# EAGLE design tomo (EAGLE 9.4.2)

## Sheet 1 of 3
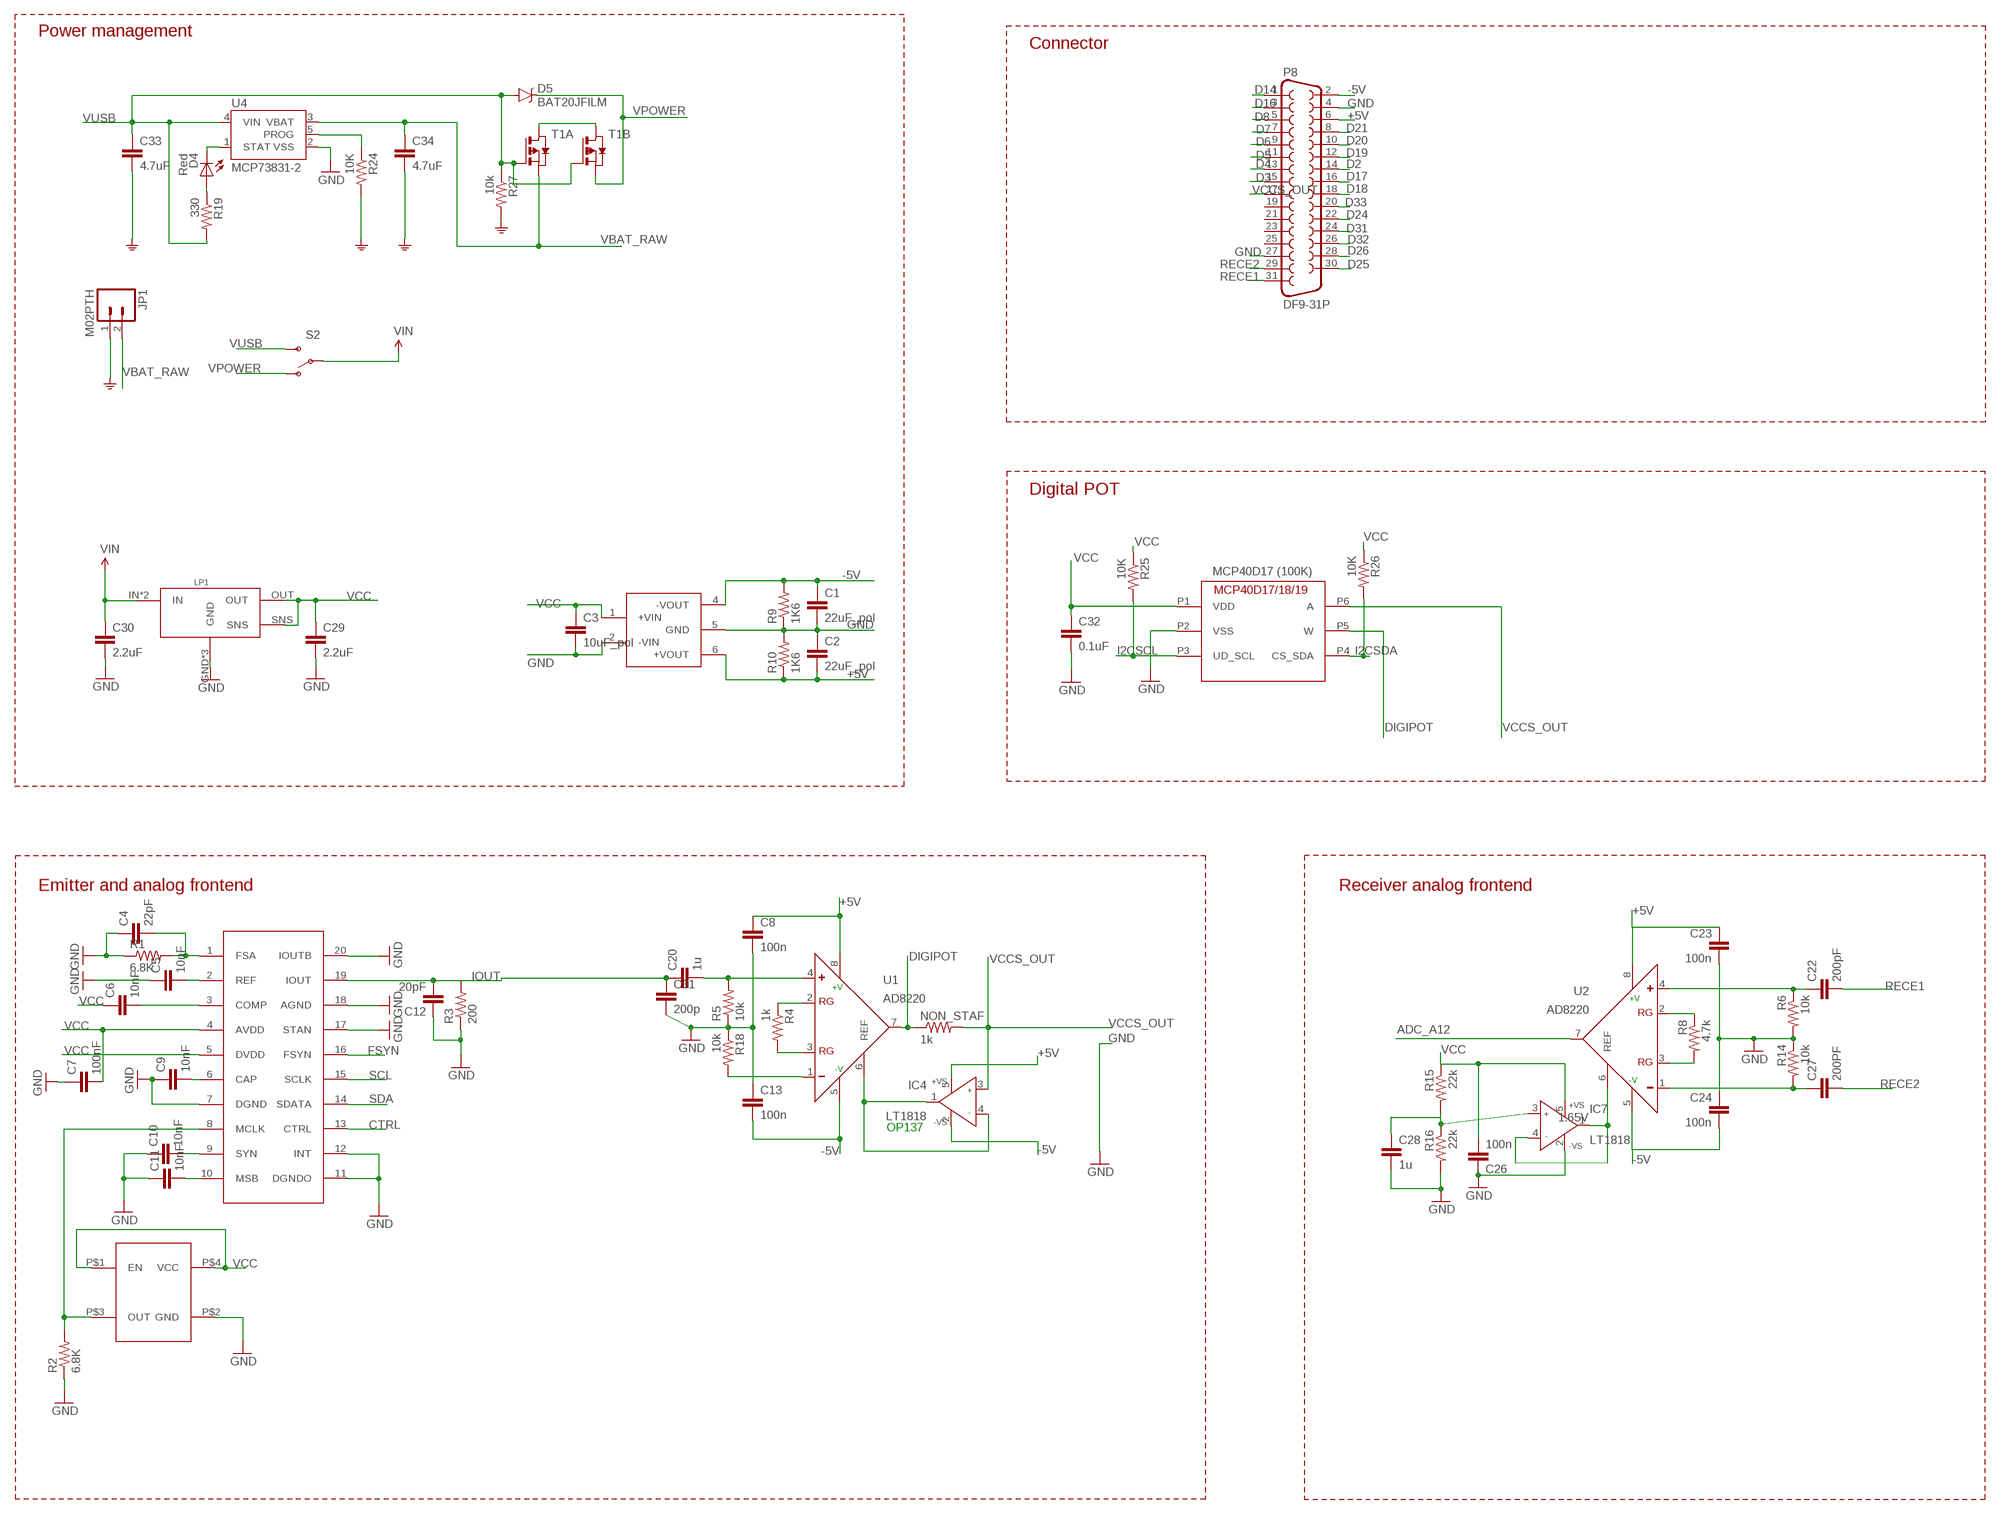
[diagram p0: schematic, sheet 1]

### Parts
C1  22uF_pol  0.1UF-25V(+80/-20%)(0603)  [0603-CAP]
C2  22uF_pol  0.1UF-25V(+80/-20%)(0603)  [0603-CAP]
C3  10uF_pol  0.1UF-25V(+80/-20%)(0603)  [0603-CAP]
C4  22pF  1.0UF-16V-10%(0603)  [0603-CAP]
C5  10nF  1.0UF-16V-10%(0603)  [0603-CAP]
C6  10nF  1.0UF-16V-10%(0603)  [0603-CAP]
C7  100nF  1.0UF-16V-10%(0603)  [0603-CAP]
C8  100n  0.1UF-25V(+80/-20%)(0603)  [0603-CAP]
C9  10nF  1.0UF-16V-10%(0603)  [0603-CAP]
C10  10nF  1.0UF-16V-10%(0603)  [0603-CAP]
C11  10nF  1.0UF-16V-10%(0603)  [0603-CAP]
C12  20pF  1.0UF-16V-10%(0603)  [0603-CAP]
C13  100n  0.1UF-25V(+80/-20%)(0603)  [0603-CAP]
C20  1u  0.1UF-25V(+80/-20%)(0603)  [0603-CAP]
C22  200pF  0.1UF-25V(+80/-20%)(0603)  [0603-CAP]
C23  100n  0.1UF-25V(+80/-20%)(0603)  [0603-CAP]
C24  100n  0.1UF-25V(+80/-20%)(0603)  [0603-CAP]
C26  100n  0.1UF-25V(+80/-20%)(0603)  [0603-CAP]
C27  200PF  0.1UF-25V(+80/-20%)(0603)  [0603-CAP]
C28  1u  0.1UF-25V(+80/-20%)(0603)  [0603-CAP]
C29  2.2uF  0.1UF-16V(+-10%)(0402)  [0402-CAP]
C30  2.2uF  0.1UF-16V(+-10%)(0402)  [0402-CAP]
C31  200p  0.1UF-25V(+80/-20%)(0603)  [0603-CAP]
C32  0.1uF  0.1UF-16V(+-10%)(0402)  [0402-CAP]
C33  4.7uF  CAP0402-CAP  [0402-CAP]
C34  4.7uF  CAP0402-CAP  [0402-CAP]
D4  Red  LED0603  [LED-0603]
D5  BAT20JFILM  [SOD-323]
IC4  LT1818  AD8541RJ  [SOT23-5]
IC7  LT1818  AD8541RJ  [SOT23-5]
JP1  M02PTH  [1X02]
LP1  LP38691SD  [WSON_6]
NON_STAF  1k  1.2MOHMS-1/10W-1%(0603)  [0603-RES]
P8  DF9-31P  [DF9-31P]
R1  6.8K  1.5KOHM-1/10W-1%(0603)  [0603]
R2  6.8K  1.5KOHM-1/10W-1%(0603)  [0603]
R3  200  1.5KOHM-1/10W-1%(0603)  [0603]
R4  1k  1.2MOHMS-1/10W-1%(0603)  [0603-RES]
R5  10k  1.2MOHMS-1/10W-1%(0603)  [0603-RES]
R6  10k  0.05OHM-1/5W-1%(0603)  [0603]
R8  4.7k  0.05OHM-1/5W-1%(0603)  [0603]
R9  1K6  2.2KOHM-1/10W-1%(0603)  [0603-RES]
R10  1K6  2.2KOHM-1/10W-1%(0603)  [0603-RES]
R14  10k  0.05OHM-1/5W-1%(0603)  [0603]
R15  22k  0.05OHM-1/5W-1%(0603)  [0603]
R16  22k  0.05OHM-1/5W-1%(0603)  [0603]
R18  10k  1.2MOHMS-1/10W-1%(0603)  [0603-RES]
R19  330  RESISTOR0402-RES  [0402-RES]
R24  10K  RESISTOR0402-RES  [0402-RES]
R25  10K  RESISTOR0402  [0402-RES]
R26  10K  RESISTOR0402  [0402-RES]
R27  10k  RESISTOR0402-RES  [0402-RES]
S2  SWITCH-SPDT-SMD-A  [SWITCH-SPST-SMD-A]
T1  BSS84DW  PMOSFET2  [SOT363]
U1  AD8220  [MSOP8]
U2  AD8220  [MSOP8]
U4  MCP73831-2  MCP73831  [SOT23-5]
U$2  AD5930  [TSSOP-20]
U$3  OSC  [OSC]
U$4  DCDC_CONVERTOR  [DCDC_CONVERTOR]
U$6  MCP40D17/18/19  [SC70-6]

### Nets
1.65V: IC7.1(OUT) IC7.4(IN-) U2.6(REF)
+5V: C2.2 C8.1 C23.1 IC4.5(+VS) P8.6 R10.1 U1.8(+V) U2.8(+V) U$4.6(+VOUT)
-5V: C1.1 C13.2 C24.2 IC4.2(-VS) P8.2 R9.2 U1.5(-V) U2.5(-V) U$4.4(-VOUT)
ADC_A12: U2.7(OUT) ; also sheet 2
CTRL: U$2.13(CTRL) ; also sheet 2
D2: P8.14 ; also sheet 2
D3: P8.15 ; also sheet 2
D4: P8.13 ; also sheet 2
D5: P8.11 ; also sheet 2
D6: P8.9 ; also sheet 2
D7: P8.7 ; also sheet 2
D8: P8.5 ; also sheet 2
D14: P8.1 ; also sheet 2
D16: P8.3 ; also sheet 2
D17: P8.16 ; also sheet 2
D18: P8.18 ; also sheet 2
D19: P8.12 ; also sheet 2
D20: P8.10 ; also sheet 2
D21: P8.8 ; also sheet 2
D24: P8.22 ; also sheet 2
D25: P8.30 ; also sheet 2
D26: P8.28 ; also sheet 2
D31: P8.24 ; also sheet 2
D32: P8.26 ; also sheet 2
D33: P8.20 ; also sheet 2
DIGIPOT: NON_STAF.1 U1.7(OUT) U$6.P5(W)
FSYN: U$2.16(FSYN) ; also sheet 2
GND: C1.2 C2.1 C3.2 C4.1 C5.1 C7.1 C8.2 C9.1 C10.1 C11.1 C12.1 C13.1 C23.2 C24.1 C26.1 C28.2 C29.2 C30.2 C31.2 C32.2 C33.2 C34.2 IC7.2(-VS) JP1.1 LP1.GND LP1.N/C(GND) LP1.THERMAL(GND) P8.4 P8.27 R1.1 R2.1 R3.1 R5.1 R6.2 R9.1 R10.2 R14.1 R16.2 R18.1 R24.2 R27.2 U4.2(VSS) U$2.7(DGND) U$2.11(DGNDO) U$2.12(INT) U$2.17(STAN) U$2.18(AGND) U$2.20(IOUTB) U$3.P$2(GND) U$4.2(-VIN) U$4.5(GND) U$6.P2(VSS) ; also sheet 2,3
I2CSCL: R25.2 U$6.P3(UD_SCL) ; also sheet 2
I2CSDA: R26.2 U$6.P4(CS_SDA) ; also sheet 2
IOUT: C12.2 C20.1 C31.1 R3.2 U$2.19(IOUT)
N$1: C4.2 R1.2 U$2.1(FSA)
N$2: C6.2 U$2.3(COMP)
N$3: C5.2 U$2.2(REF)
N$4: C9.2 U$2.6(CAP)
N$5: R2.2 U$2.8(MCLK) U$3.P$3(OUT)
N$6: C10.2 U$2.9(SYN)
N$7: C11.2 U$2.10(MSB)
N$8: R4.1 U1.2(RG)
N$9: C28.1 IC7.3(IN+) R15.2 R16.1
N$15: C20.2 R5.2 U1.4(+)
N$16: R4.2 U1.3(RG)
N$24: IC4.1(OUT) IC4.4(IN-) U1.6(REF)
N$31: R18.2 U1.1(-)
N$33: D4.A R19.1
N$34: T1.3(A:D) T1.6(B:D)
N$36: C22.1 R6.1 U2.4(+)
N$37: C27.1 R14.2 U2.1(-)
N$38: R8.1 U2.2(RG)
N$39: R8.2 U2.3(RG)
PROG: R24.1 U4.5(PROG)
RECE1: C22.2 P8.31
RECE2: C27.2 P8.29
SCL: U$2.15(SCLK) ; also sheet 2
SDA: U$2.14(SDATA) ; also sheet 2
STAT: D4.C U4.1(STAT)
VBAT_RAW: C34.1 JP1.2 T1.4(A:S) U4.3(VBAT)
VCC: C3.1 C6.1 C7.2 C26.2 C29.1 C32.1 IC7.5(+VS) LP1.OUT LP1.SNS R15.1 R25.1 R26.1 U$2.4(AVDD) U$2.5(DVDD) U$3.P$1(EN) U$3.P$4(VCC) U$4.1(+VIN) U$6.P1(VDD)
VCCS_OUT: IC4.3(IN+) NON_STAF.2 P8.17 U$6.P6(A)
VIN: C30.1 LP1.IN LP1.IN2(IN) S2.2(P) ; also sheet 2
VPOWER: D5.C S2.1(O) T1.1(B:S)
VUSB: C33.1 D5.A R19.2 R27.1 S2.3(S) T1.2(B:G) T1.5(A:G) U4.4(VIN) ; also sheet 2
Unconnected: P8.19 P8.21 P8.23 P8.25

### Notes on the sheet
- Power management
- Connector
- Digital POT
- MCP40D17 (100K)
- Emitter and analog frontend | Receiver analog frontend
- OP137

## Sheet 2 of 3
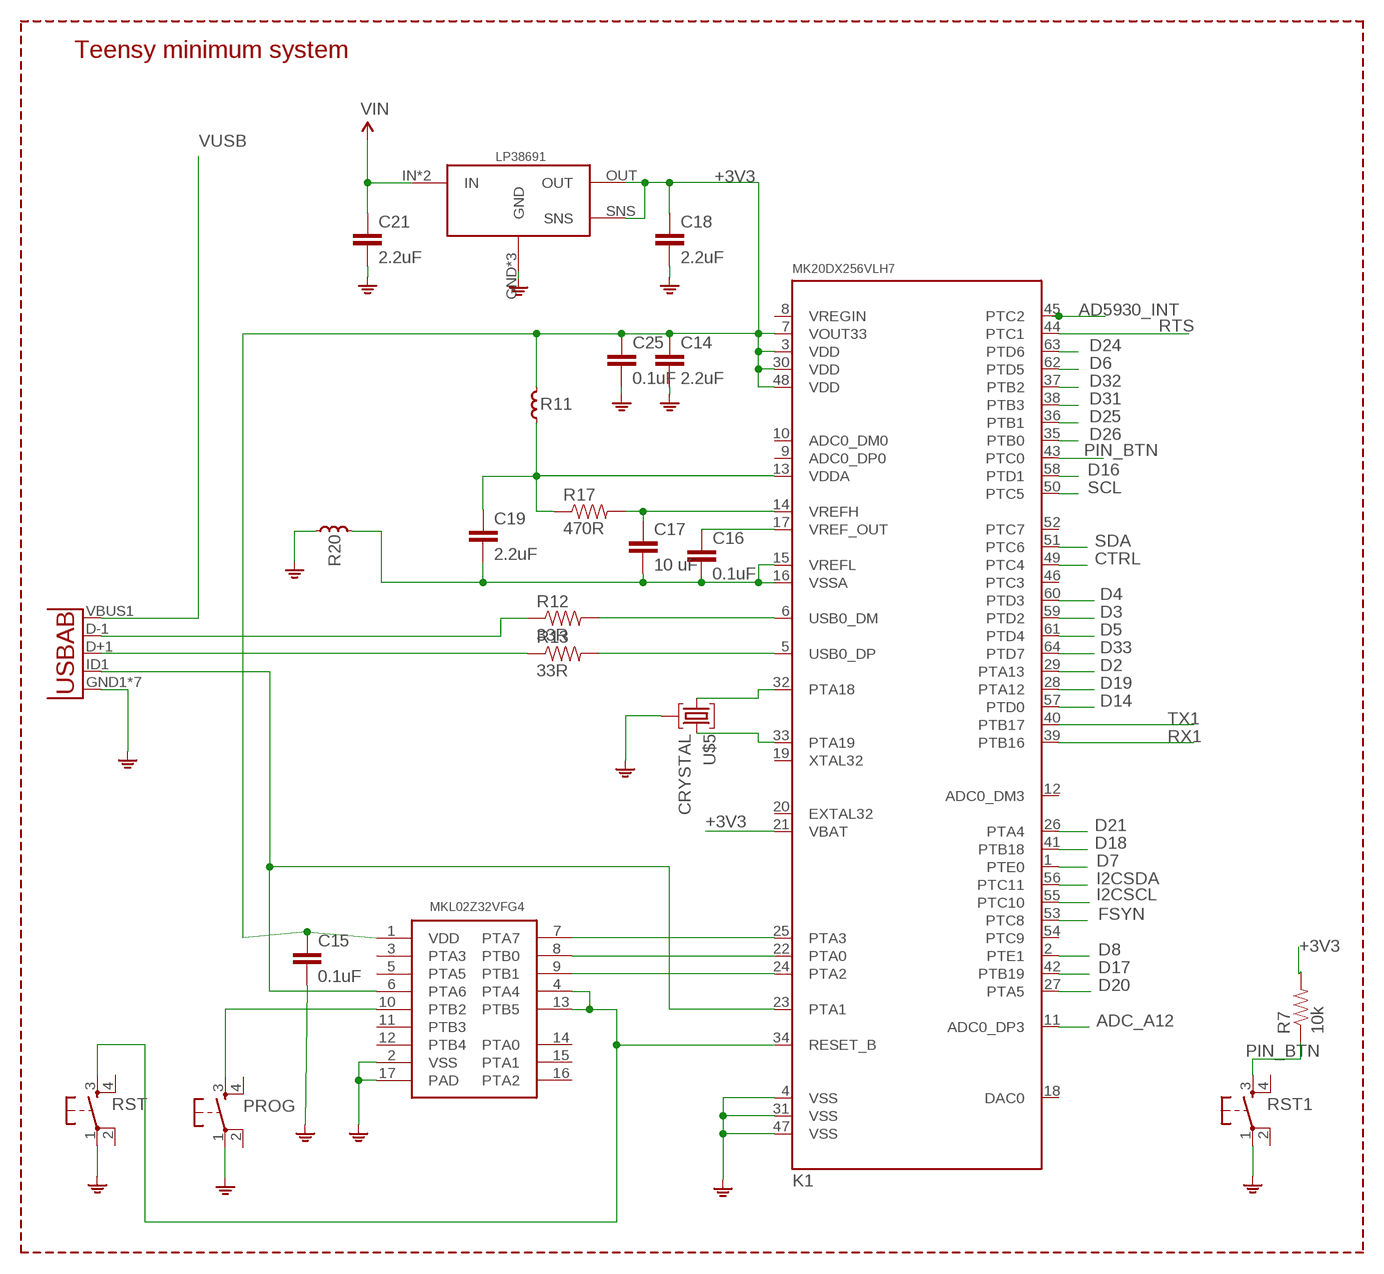
[diagram p1: schematic, sheet 2]

### Parts
C14  2.2uF  0.1UF-25V(+80/-20%)(0603)  [0603-CAP]
C15  0.1uF  0.1UF-16V(+-10%)(0402)  [0402-CAP]
C16  0.1uF  0.1UF-16V(+-10%)(0402)  [0402-CAP]
C17  10 uF  0.1UF-16V(+-10%)(0402)  [0402-CAP]
C18  2.2uF  0.1UF-16V(+-10%)(0402)  [0402-CAP]
C19  2.2uF  0.1UF-16V(+-10%)(0402)  [0402-CAP]
C21  2.2uF  0.1UF-16V(+-10%)(0402)  [0402-CAP]
C25  0.1uF  0.1UF-16V(+-10%)(0402)  [0402-CAP]
K1  MK20DX256VLH7  [LQFP64-05]
LP38691  LP38691SD  [WSON_6]
PROG  KMR211GLFS  TAC_SWITCHSMD  [TACTILE_SWITCH_SMD]
R7  10k  22OHM1/10W1%(0402)  [0402-RES]
R11  FERRITE  [L0603]
R12  33R  22OHM1/10W1%(0402)  [0402-RES]
R13  33R  22OHM1/10W1%(0402)  [0402-RES]
R17  470R  22OHM1/10W1%(0402)  [0402-RES]
R20  FERRITE  [L0603]
RST  KMR211GLFS  TAC_SWITCHSMD  [TACTILE_SWITCH_SMD]
RST1  KMR211GLFS  TAC_SWITCHSMD  [TACTILE_SWITCH_SMD]
U5  USB""  [USB-MICRO-SMD]
U$5  CRYSTAL  [CRYSTAL]
U$14  MKL02Z32VFG4_  [QFN16_3X3]

### Nets
+3V3: C14.1 C15.1 C18.1 C25.1 K1.3(VDD) K1.7(VOUT33) K1.21(VBAT) K1.30(VDD) K1.48(VDD) LP38691.OUT LP38691.SNS R7.2 R11.2 U$14.1(VDD) ; also sheet 3
AD5930_INT: K1.45(PTC2)
ADC_A12: K1.11(ADC0_DP3) ; also sheet 1
CTRL: K1.49(PTC4) ; also sheet 1
D2: K1.29(PTA13) ; also sheet 1
D3: K1.59(PTD2) ; also sheet 1
D4: K1.60(PTD3) ; also sheet 1
D5: K1.61(PTD4) ; also sheet 1
D6: K1.62(PTD5) ; also sheet 1
D7: K1.1(PTE0) ; also sheet 1
D8: K1.2(PTE1) ; also sheet 1
D14: K1.57(PTD0) ; also sheet 1
D16: K1.58(PTD1) ; also sheet 1
D17: K1.42(PTB19) ; also sheet 1
D18: K1.41(PTB18) ; also sheet 1
D19: K1.28(PTA12) ; also sheet 1
D20: K1.27(PTA5) ; also sheet 1
D21: K1.26(PTA4) ; also sheet 1
D24: K1.63(PTD6) ; also sheet 1
D25: K1.36(PTB1) ; also sheet 1
D26: K1.35(PTB0) ; also sheet 1
D31: K1.38(PTB3) ; also sheet 1
D32: K1.37(PTB2) ; also sheet 1
D33: K1.64(PTD7) ; also sheet 1
FSYN: K1.53(PTC8) ; also sheet 1
GND: C14.2 C15.2 C18.2 C21.2 C25.2 K1.4(VSS) K1.31(VSS) K1.47(VSS) LP38691.GND LP38691.N/C(GND) LP38691.THERMAL(GND) PROG.1 R20.1 RST1.1 RST.1 U5.GND1(GND) U5.P$1(GND) U5.P$2(GND) U5.P$3(GND) U5.P$4(GND) U5.P$5(GND) U5.P$6(GND) U$5.GND1 U$5.GND2 U$14.2(VSS) U$14.17(PAD) ; also sheet 1,3
I2CSCL: K1.55(PTC10) ; also sheet 1
I2CSDA: K1.56(PTC11) ; also sheet 1
N$10: K1.24(PTA2) U$14.9(PTB1)
N$11: K1.5(USB0_DP) R13.2
N$12: K1.6(USB0_DM) R12.2
N$13: R13.1 U5.D+1(D+)
N$14: C16.1 K1.17(VREF_OUT)
N$21: R12.1 U5.D-1(D-)
N$22: K1.23(PTA1) U5.ID1(USBID) U$14.6(PTA6)
N$23: K1.22(PTA0) U$14.8(PTB0)
N$25: K1.32(PTA18) U$5.SIG1
N$26: K1.33(PTA19) U$5.SIG2
N$27: C17.1 K1.14(VREFH) R17.2
N$28: C16.2 C17.2 C19.2 K1.15(VREFL) K1.16(VSSA) R20.2
N$29: C19.1 K1.13(VDDA) R11.1 R17.1
N$66: PROG.3 U$14.10(PTB2)
N$72: K1.25(PTA3) U$14.7(PTA7)
PIN_BTN: K1.43(PTC0) R7.1 RST1.3
RST: K1.34(RESET_B) RST.3 U$14.4(PTA4) U$14.13(PTB5)
RTS: K1.44(PTC1) ; also sheet 3
RX1: K1.39(PTB16) ; also sheet 3
SCL: K1.50(PTC5) ; also sheet 1
SDA: K1.51(PTC6) ; also sheet 1
TX1: K1.40(PTB17) ; also sheet 3
VIN: C21.1 LP38691.IN LP38691.IN2(IN) ; also sheet 1
VUSB: U5.VBUS1(VBUS) ; also sheet 1
Unconnected: K1.8(VREGIN) K1.9(ADC0_DP0) K1.10(ADC0_DM0) K1.12(ADC0_DM3) K1.18(DAC0) K1.19(XTAL32) K1.20(EXTAL32) K1.46(PTC3) K1.52(PTC7) K1.54(PTC9) PROG.2 PROG.4 RST1.2 RST1.4 RST.2 RST.4 U$14.3(PTA3) U$14.5(PTA5) U$14.11(PTB3) U$14.12(PTB4) U$14.14(PTA0) U$14.15(PTA1) U$14.16(PTA2)

### Notes on the sheet
- Teensy minimum system

## Sheet 3 of 3
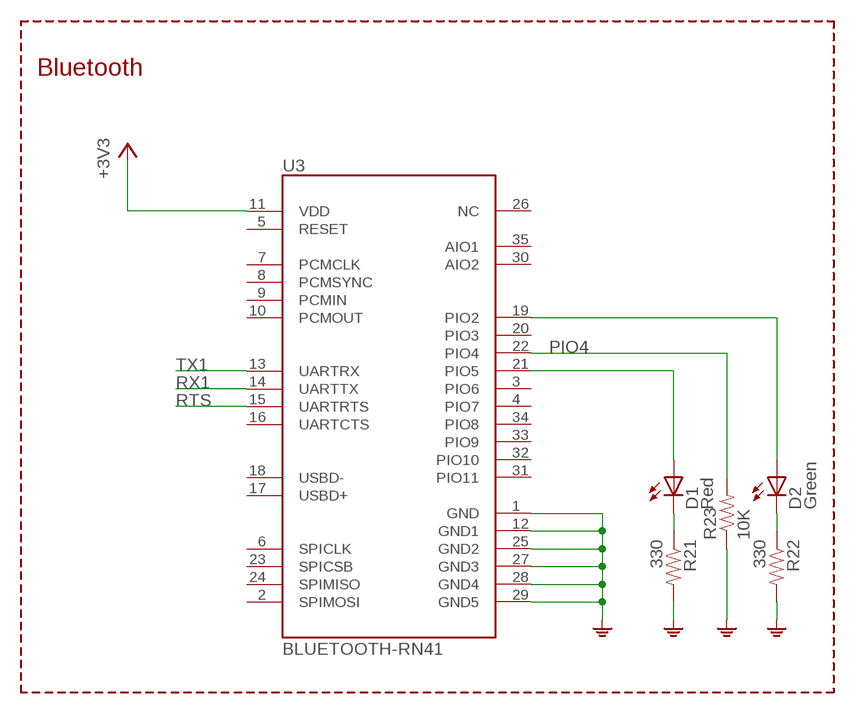
[diagram p2: schematic, sheet 3]

### Parts
D1  Red  LED0603  [LED-0603]
D2  Green  LED0603  [LED-0603]
R21  330  RESISTOR0402-RES  [0402-RES]
R22  330  RESISTOR0402-RES  [0402-RES]
R23  10K  RESISTOR0402-RES  [0402-RES]
U3  BLUETOOTH-RN41  BLUETOOTH-RN41"  [RN41]

### Nets
+3V3: U3.11(VDD) ; also sheet 2
D1: D1.C R21.1
D9: D2.C R22.1
GND: R21.2 R22.2 R23.1 U3.1(GND) U3.12(GND1) U3.25(GND2) U3.27(GND3) U3.28(GND4) U3.29(GND5) ; also sheet 1,2
N$30: D1.A U3.21(PIO5)
N$32: D2.A U3.19(PIO2)
PIO4: R23.2 U3.22(PIO4)
RTS: U3.15(UARTRTS) ; also sheet 2
RX1: U3.14(UARTTX) ; also sheet 2
TX1: U3.13(UARTRX) ; also sheet 2
Unconnected: U3.2(SPIMOSI) U3.3(PIO6) U3.4(PIO7) U3.5(RESET) U3.6(SPICLK) U3.7(PCMCLK) U3.8(PCMSYNC) U3.9(PCMIN) U3.10(PCMOUT) U3.16(UARTCTS) U3.17(USBD+) U3.18(USBD-) U3.20(PIO3) U3.23(SPICSB) U3.24(SPIMISO) U3.26(NC) U3.30(AIO2) U3.31(PIO11) U3.32(PIO10) U3.33(PIO9) U3.34(PIO8) U3.35(AIO1)

### Notes on the sheet
- Bluetooth

## Library data of the parts
C1-C3 C8 C13 C14 C20 C22-C24 C26-C28 C31 = SparkFun-Capacitors:0.1UF-25V(+80/-20%)(0603): CAP-00810 Ceramic Standard decoupling cap; PROD_ID: CAP-00810; VALUE: 0.1uF
C4-C7 C9-C12 = SparkFun-Capacitors:1.0UF-16V-10%(0603): CAP-00868; PROD_ID: CAP-00868; VALUE: 1.0uF
C15 C16 C25 C32 = SparkFun-Capacitors:0.1UF-16V(+-10%)(0402); PROD_ID: CAP-12416
C17-C19 C21 C29 C30 = SparkFun-Capacitors:0.1UF-16V(+-10%)(0402); PROD_ID: CAP-12416; VALUE: 0.1uF
C33 C34 = SparkFun:CAP: Capacitor Standard 0603 ceramic capacitor, and 0.1" leaded capacitor.
D1 D2 D4 = SparkFun:LED: LEDs Standard schematic elements and footprints for 5mm, 3mm, 1206, and 0603 sized LEDs. 5mm - Spark Fun Electronics SKU : COM-00529 (and others)
D5 = SparkFun-DiscreteSemi:BAT20JFILM: 23V, 1A Schottky diode, SOD-323 package; PROD_ID: DIO-11623
IC4 IC7 = analog-devices:AD8541: General-Purpose CMOS Rail-to-Rail Amplifiers Source: http://www.analog.com/static/imported-files/data_sheets/AD8541_8542_8544.pdf; MF: ALTERA CORPORATION; MPN: AD8541ARTZ-REEL7; OC_FARNELL: 1464963; OC_NEWARK: 88H0268
JP1 = SparkFun-Connectors:M02: Standard 2-pin 0.1" header. Use with - straight break away headers ( PRT-00116) - right angle break away headers (PRT-00553) - swiss pins (PRT-00743) - machine pins (PRT-00117) - female headers (PRT-00115) Molex polarized connector foot print use with: PRT-08233 with associated crimp pins and housings. 2.54_SCREWTERM for use with PRT-10571. 3.5mm Screw Terminal footprints for PRT-08084 5mm Screw Terminal footprints for use with PRT-08432
K1 = t32_ref:MK20DX256VLH7; DESC: MK20DX256VLH7; MF: NXP; MPN: MK20DX256VLH7; OC_MOUSER: 841-MK20DX256VLH7; PACKAGE: LQFP-64; TYPE: Microcontroller
LP1 LP38691 = Teensy_3_and_LC_Series_Boards_v1.1:LP38691SD
NON_STAF R4 R5 R18 = SparkFun-Resistors:1.2MOHMS-1/10W-1%(0603): RES-10055; PROD_ID: RES-10055; VALUE: 1.2M
P8 = con-hirose:DF9-31P
PROG RST RST1 = Spark:TAC_SWITCH: SMD Tactiile Switch
R1-R3 = SparkFun-Resistors:1.5KOHM-1/10W-1%(0603): RES-08306; PROD_ID: RES-08306; VALUE: 1.5KOHM
R6 R8 R14-R16 = SparkFun-Resistors:0.05OHM-1/5W-1%(0603); PROD_ID: RES-12535
R7 R12 R13 R17 = SparkFun-Resistors:22OHM1/10W1%(0402); PROD_ID: RES-12427; VALUE: 22
R9 R10 = SparkFun-Resistors:2.2KOHM-1/10W-1%(0603): RES-08272; PROD_ID: RES-08272; VALUE: 2.2k
R11 R20 = t32_ref:FERRITE; DESC: 600R / 100MHz; MF: Murata Electronics; MPN: BLM18AG601SN1D; OC_MOUSER: 81-BLM11A601S; PACKAGE: 0603; TYPE: Ferrite
R19 R21-R24 R27 = SparkFun:RESISTOR: Resistor Basic schematic elements and footprints for 0603, 1206, and PTH resistors.
R25 R26 = SparkFun-Resistors:RESISTOR: Resistor Basic schematic elements and footprints for 0603, 1206, and PTH resistors.
S2 = SparkFun-Electromechanical:SWITCH-SPDT: SPDT Switch Simple slide switch, Spark Fun Electronics SKU : COM-00102 DPDT SMT slide switch, AYZ0202, SWCH-08179
T1 = Teensy_3_and_LC_Series_Boards_v1.1:PMOSFET2
U1 U2 = openebi:AD8220
U3 = ScratchPad:BLUETOOTH-RN41
U4 = SparkFun:MCP73831: Microchip's MCP73831 Miniature single cell, fully integrated Li-Ion, Li-polymer charge management controller http://ww1.microchip.com/downloads/en/DeviceDoc/21984a.pdf
U5 = MicroUSB:USB: This is a USB AB connector that is compatible with USB OTG. i.e. this connector can serve as a host or device
U$2 = Teensy_3_and_LC_Series_Boards_v1.1:AD5930
U$3 = Teensy_3_and_LC_Series_Boards_v1.1:OSC
U$4 = MGC3130:DCDC_CONVERTOR
U$5 = Teensy_3_and_LC_Series_Boards_v1.1:CRYSTAL
U$6 = ff3:MCP40D17/18/19
U$14 = Teensy_3_and_LC_Series_Boards_v1.1:MKL02Z32VFG4_

## Board
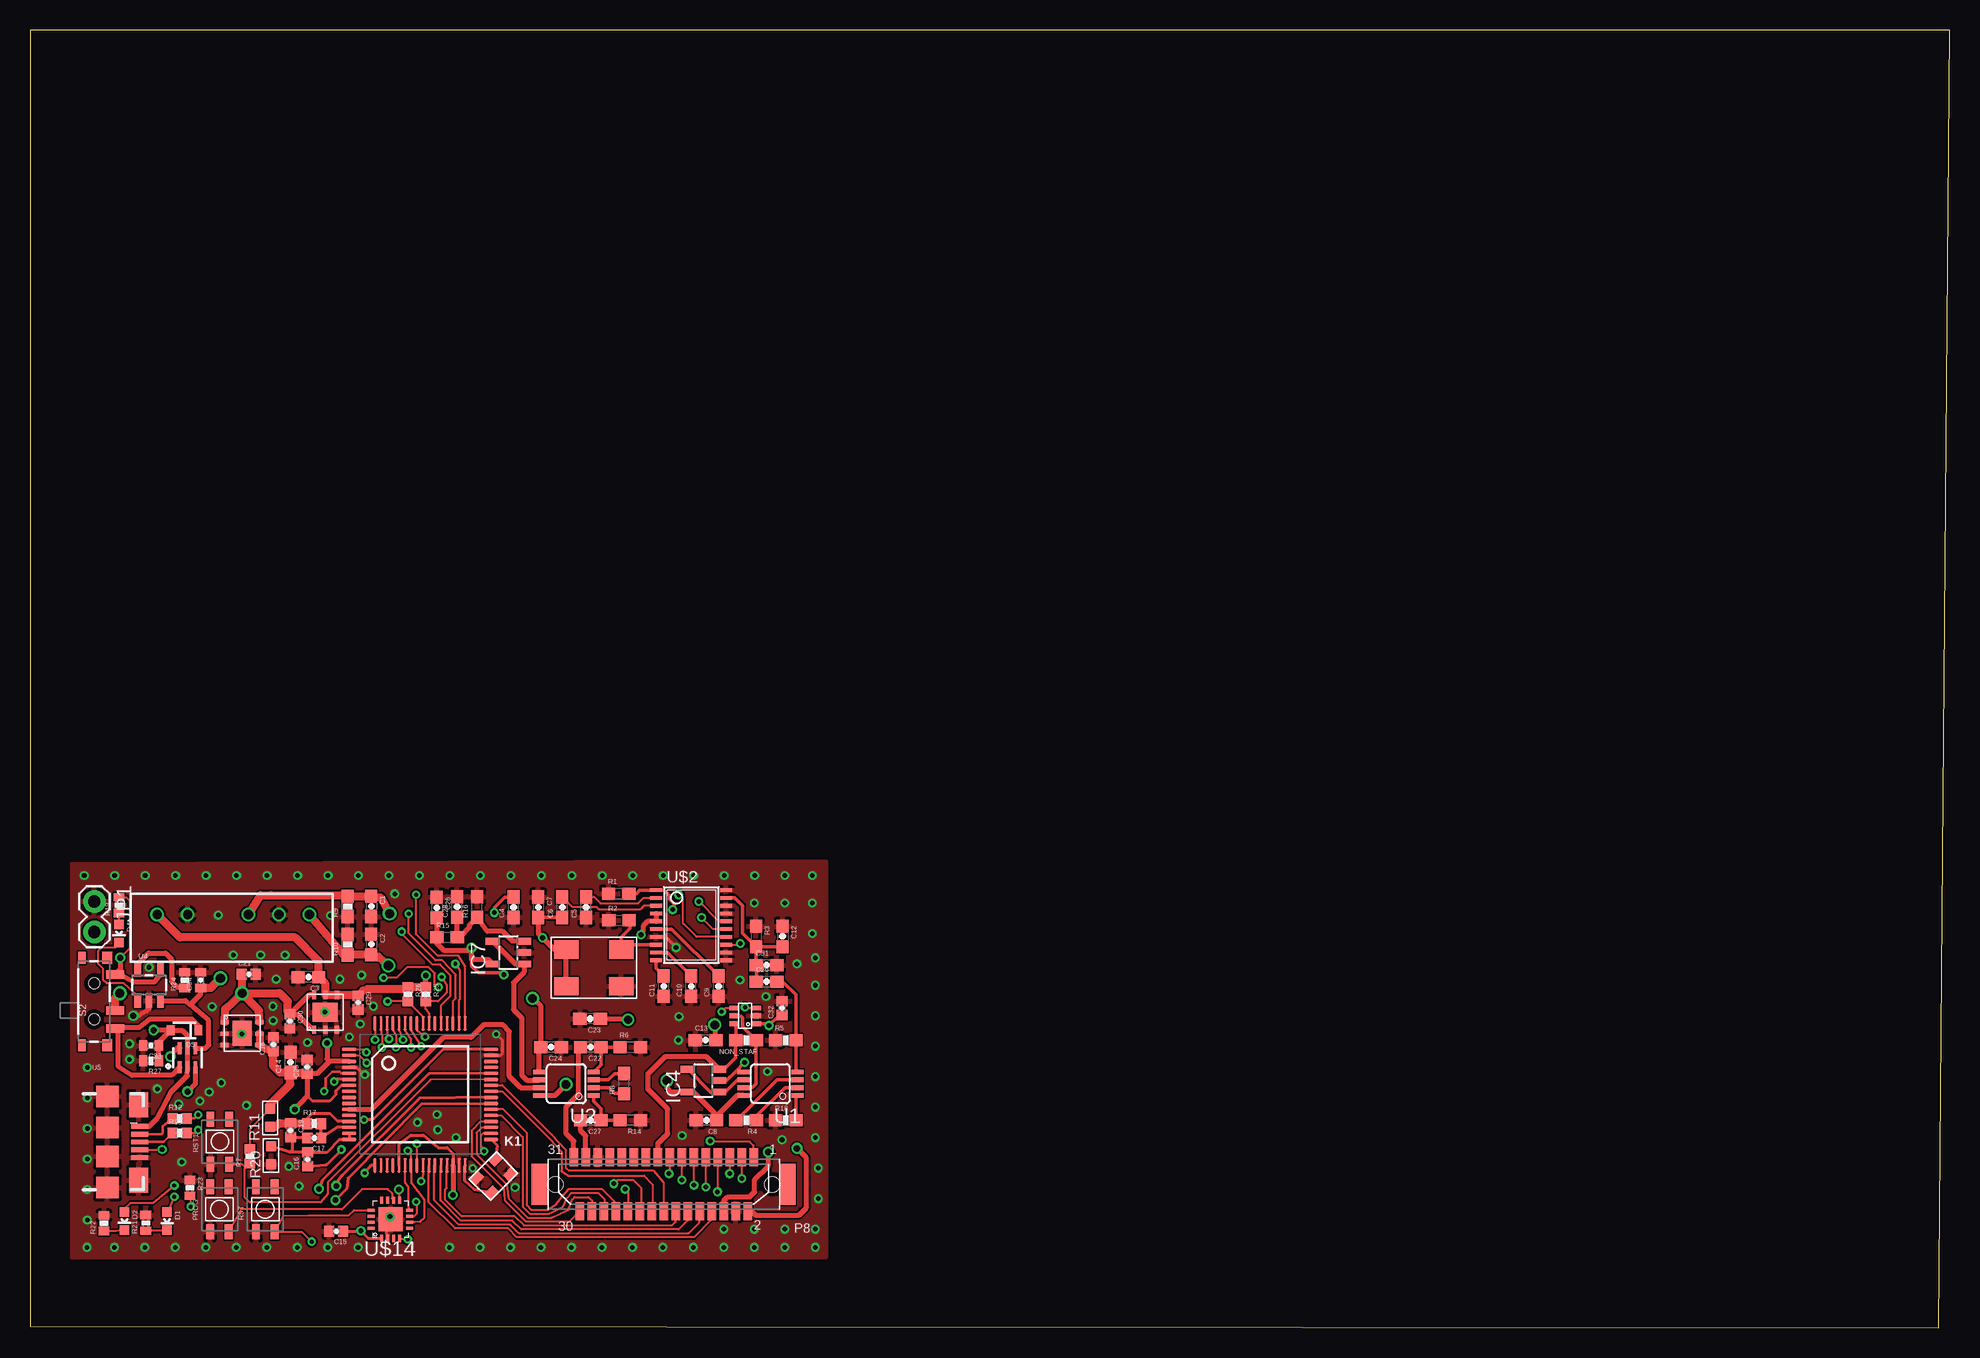
[diagram p3: board, top side]
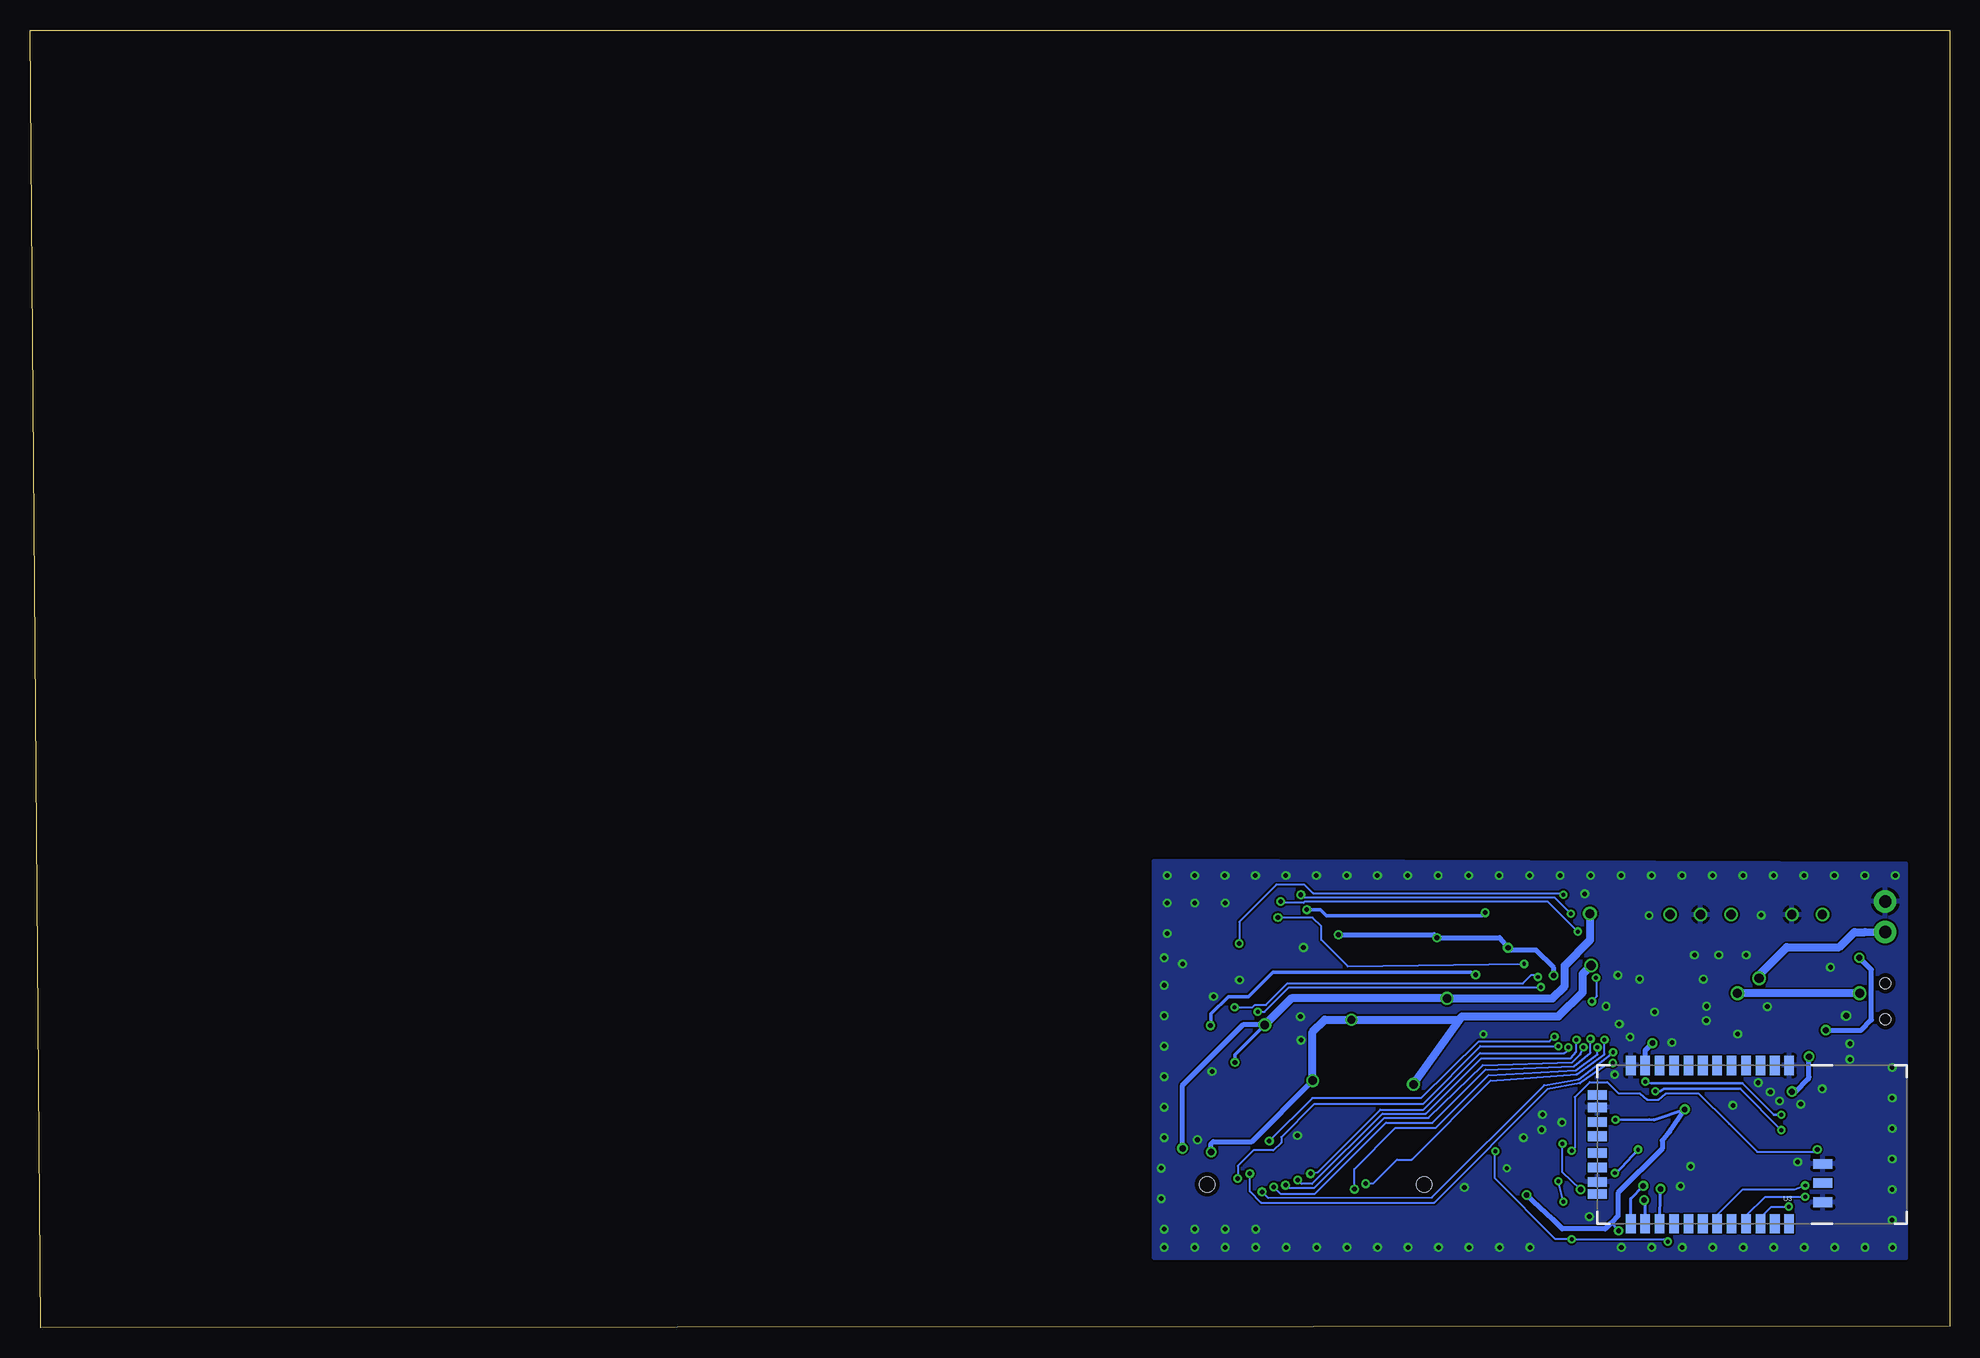
[diagram p4: board, bottom side, seen from below]

Size 160 x 108.15 mm. Coordinates in mm from the lower left corner, seen from the top.
Outline: 0,0.15 159.09,0 160,108.15 0,108.15 0,0.15
Copper layers (1*16): Top 0.0356mm / dielectric 1.5011mm / Bottom 0.0356mm
Design rules "oshpark-2layer": minimum track width 6mil, minimum drill 13mil, track to track 6mil, track to pad 6mil, pad to pad 6mil, via to via 6mil, smd to smd 6mil, copper to edge 15mil, drill to drill 6mil, minimum pad ring 7mil, minimum via ring 7mil, stop-mask expansion 2.5mil, vias tented up to drill 0mil, thermal gap 10mil

### Footprints (pad centres in the part's own frame; a part is rotated, then mirrored left to right if it is on the bottom)
0603-CAP = smd 1.1 x 1: 1 -0.85,0; 2 0.85,0
0402-CAP = smd 0.85 x 0.9: 1 -0.58,0; 2 0.58,0
0402-CAP' = smd 0.7 x 0.9: 1 -0.65,0; 2 0.65,0
LED-0603 = smd 0.8 x 0.8: A 0,-0.75; C 0,0.75
SOD-323 = smd 0.63 x 0.83: A 1.15,0; C -1.15,0
SOT23-5 = smd 0.55 x 1.2: 1 -0.95,-1.3; 2 0,-1.3; 3 0.95,-1.3; 4 0.95,1.3; 5 -0.95,1.3
1X02 = drill 1.016 pad 1.88: 1 0,0; 2 2.54,0
LQFP64-05 = smd 1.2 x 0.25: 1 -5.915,3.759; 2 -5.915,3.251; 3 -5.915,2.743; 4 -5.915,2.261; 5 -5.915,1.753; 6 -5.915,1.245; 7 -5.915,0.762; 8 -5.915,0.254; 9 -5.915,-0.254; 10 -5.915,-0.762; 11 -5.915,-1.245; 12 -5.915,-1.753; 13 -5.915,-2.261; 14 -5.915,-2.743; 15 -5.915,-3.251; 16 -5.915,-3.759; 33 5.915,-3.759; 34 5.915,-3.251; 35 5.915,-2.743; 36 5.915,-2.261; 37 5.915,-1.753; 38 5.915,-1.245; 39 5.915,-0.762; 40 5.915,-0.254; 41 5.915,0.254; 42 5.915,0.762; 43 5.915,1.245; 44 5.915,1.753; 45 5.915,2.261; 46 5.915,2.743; 47 5.915,3.251; 48 5.915,3.759 | smd 0.25 x 1.2: 17 -3.759,-5.915; 18 -3.251,-5.915; 19 -2.743,-5.915; 20 -2.261,-5.915; 21 -1.753,-5.915; 22 -1.245,-5.915; 23 -0.762,-5.915; 24 -0.254,-5.915; 25 0.254,-5.915; 26 0.762,-5.915; 27 1.245,-5.915; 28 1.753,-5.915; 29 2.261,-5.915; 30 2.743,-5.915; 31 3.251,-5.915; 32 3.759,-5.915; 49 3.759,5.915; 50 3.251,5.915; 51 2.743,5.915; 52 2.261,5.915; 53 1.753,5.915; 54 1.245,5.915; 55 0.762,5.915; 56 0.254,5.915; 57 -0.254,5.915; 58 -0.762,5.915; 59 -1.245,5.915; 60 -1.753,5.915; 61 -2.261,5.915; 62 -2.743,5.915; 63 -3.251,5.915; 64 -3.759,5.915
WSON_6 = smd 0.7 x 0.35: GND -1.472,-0.042; IN -1.472,0.908; IN2 1.428,0.908; N/C -1.472,-0.992; OUT 1.428,-0.992; SNS 1.428,-0.042 | smd 1.6 x 2.1: THERMAL -0.024,-0.024
0603-RES = smd 1.1 x 1: 1 -0.85,0; 2 0.85,0
DF9-31P = smd 0.7 x 1.5: 1 7.5,2.25; 2 7,-2.25; 3 6.5,2.25; 4 6,-2.25; 5 5.5,2.25; 6 5,-2.25; 7 4.5,2.25; 8 4,-2.25; 9 3.5,2.25; 10 3,-2.25; 11 2.5,2.25; 12 2,-2.25; 13 1.5,2.25; 14 1,-2.25; 15 0.5,2.25; 16 0,-2.25; 17 -0.5,2.25; 18 -1,-2.25; 19 -1.5,2.25; 20 -2,-2.25; 21 -2.5,2.25; 22 -3,-2.25; 23 -3.5,2.25; 24 -4,-2.25; 25 -4.5,2.25; 26 -5,-2.25; 27 -5.5,2.25; 28 -6,-2.25; 29 -6.5,2.25; 30 -7,-2.25; 31 -7.5,2.25 | smd 1.3 x 3.4: M1 -10.35,0; M2 10.35,0 | hole 1.27: 9.05,0; -9.05,0
TACTILE_SWITCH_SMD = smd 1.25 x 0.65: 1 -1.875,0.775; 2 1.875,0.775; 3 -1.875,-0.775; 4 1.875,-0.775
0603 = smd 1.1 x 1: 1 -0.85,0; 2 0.85,0
0402-RES = smd 0.85 x 0.9: 1 -0.58,0; 2 0.58,0
L0603 = smd 0.889 x 0.889: 1 -0.762,0; 2 0.762,0
0402-RES' = smd 0.7 x 0.9: 1 -0.65,0; 2 0.65,0
SWITCH-SPST-SMD-A = smd 0.7 x 1.5: 1 -2.25,-1.75; 2 -0.75,-1.75; 3 2.25,-1.75 | smd 1 x 0.6: GND1 -3.65,1; GND3 3.65,1 | smd 1 x 0.8: GND2 -3.65,-1.1; GND4 3.65,-1.1 | hole 0.9: -1.5,0; 1.5,0
SOT363 = smd 0.3 x 0.99: 1 -0.65,-0.8; 2 0,-0.8; 3 0.65,-0.8; 4 0.65,0.81; 5 0,0.81; 6 -0.65,0.81
MSOP8 = smd 0.4 x 1: 1 -0.976,-2.263; 2 -0.326,-2.263; 3 0.324,-2.263; 4 0.974,-2.263; 5 0.974,2.262; 6 0.324,2.262; 7 -0.326,2.262; 8 -0.976,2.262
RN41 = smd 0.8 x 1.6: 1 -6.6,-6.6; 2 -5.4,-6.6; 3 -4.2,-6.6; 4 -3,-6.6; 5 -1.8,-6.6; 6 -0.6,-6.6; 7 0.6,-6.6; 8 1.8,-6.6; 9 3,-6.6; 10 4.2,-6.6; 11 5.4,-6.6; 12 6.6,-6.6; 13 6.6,6.6; 14 5.4,6.6; 15 4.2,6.6; 16 3,6.6; 17 1.8,6.6; 18 0.6,6.6; 19 -0.6,6.6; 20 -1.8,6.6; 21 -3,6.6; 22 -4.2,6.6; 23 -5.4,6.6; 24 -6.6,6.6 | smd 1.6 x 0.8: 25 -9.4,4.8; 26 -9.4,3.2; 27 -9.4,1.6; 28 9.4,3.1; 29 9.4,-3.1; 30 9.4,-4.122; 31 9.4,-1.9; 32 9.4,-0.7; 33 9.4,0.7; 34 9.4,1.9; 35 9.4,4.122
USB-MICRO-SMD = smd 1.4 x 0.4: D+1 2.7,0; D-1 2.7,0.65; GND1 2.7,-1.3; ID1 2.7,-0.65; VBUS1 2.7,1.3 | smd 1.6 x 2.1: P$1 2.6,3.1; P$2 2.6,-3.2 | smd 1.9 x 1.8: P$3 0,-3.8; P$4 0,3.8; P$5 0,1.2; P$6 0,-1.2
TSSOP-20 = smd 0.305 x 0.991: 1 -2.925,-2.918; 2 -2.275,-2.918; 3 -1.625,-2.918; 4 -0.975,-2.918; 5 -0.325,-2.918; 6 0.325,-2.918; 7 0.975,-2.918; 8 1.625,-2.918; 9 2.275,-2.918; 10 2.925,-2.918; 11 2.925,2.918; 12 2.275,2.918; 13 1.625,2.918; 14 0.975,2.918; 15 0.325,2.918; 16 -0.325,2.918; 17 -0.975,2.918; 18 -1.625,2.918; 19 -2.275,2.918; 20 -2.925,2.918
OSC = smd 2.032 x 1.524: P$1 3.81,1.524; P$2 -0.762,1.524; P$3 -0.762,-1.524; P$4 3.81,-1.524
DCDC_CONVERTOR = drill 0.762: 1 -6.604,0.457; 2 -4.064,0.457; 4 1.016,0.457; 5 3.556,0.457; 6 6.096,0.457
CRYSTAL = smd 1 x 0.7: GND1 0.5,2.1; GND2 2.7,0.4; SIG1 0.5,0.4; SIG2 2.7,2.1
SC70-6 = smd 0.4 x 0.75: P1 -0.762,-1.016; P2 -0.112,-1.016; P3 0.538,-1.016; P4 0.538,0.884; P5 -0.112,0.884; P6 -0.762,0.884
QFN16_3X3 = smd 0.6 x 0.25: 1 -1.6,0.75; 2 -1.6,0.25; 3 -1.6,-0.25; 4 -1.6,-0.75; 9 1.6,-0.75; 10 1.6,-0.25; 11 1.6,0.25; 12 1.6,0.75 | smd 0.25 x 0.6: 5 -0.75,-1.6; 6 -0.25,-1.6; 7 0.25,-1.6; 8 0.75,-1.6; 13 0.75,1.6; 14 0.25,1.6; 15 -0.25,1.6; 16 -0.75,1.6 | smd 2 x 2: 17 0,0

### Placement (x,y rotation side)
C1  28.45,35.13 270 top
C2  28.45,31.95 270 top
C3  23.22,29.24 180 top
C4  40.31,35.05 90 top
C5  46.35,35.05 90 top
C6  44.37,35.05 90 top
C7  42.37,35.05 270 top
C8  56.39,17.3 180 top
C9  57.4,28.47 90 top
C10  55.12,28.47 90 top
C11  52.83,28.47 90 top
C12  62.74,32.61 270 top
C13  56.31,23.98 0 top
C14  21.72,22.12 90 top
C15  25.53,8.05 180 top
C16  23.14,14.05 90 top
C17  23.7,15.82 180 top
C18  20.29,23.62 90 top
C19  21.72,16.46 270 top
C20  61.39,28.85 0 top
C21  18.24,29.46 0 top
C22  46.74,23.39 180 top
C23  46.69,25.76 180 top
C24  43.43,23.39 180 top
C25  23.11,21.74 90 top
C26  33.91,35.03 270 top
C27  46.74,17.3 180 top
C28  35.61,35.08 90 top
C29  27.36,27.1 270 top
C30  21.67,25.55 270 top
C31  61.39,30.23 0 top
C32  62.69,26.64 90 top
C33  4.7uF  [0402-CAP']  10.08,23.52 180 top
C34  4.7uF  [0402-CAP']  14.22,28.98 90 top
D1  11.43,8.89 180 top
D2  7.87,8.92 180 top
D4  7.42,32.87 180 top
D5  12.88,24.79 180 top
IC4  56.13,20.6 90 top
IC7  39.88,31.27 90 top
JP1  5.36,35.53 270 top
K1  32.51,19.46 0 top
LP1  24.59,26.31 90 top
LP38691  17.7,24.56 0 top
NON_STAF  59.69,23.95 180 top
P8  52.83,11.96 0 top
PROG  15.8,9.88 90 top
R1  49.07,36.2 0 top
R2  49.1,33.96 0 top
R3  60.5,32.61 270 top
R4  59.69,17.3 180 top
R5  62.99,23.98 0 top
R6  50.04,23.39 0 top
R7  18.34,14.3 90 top
R8  49.53,20.35 90 top
R9  26.47,35.13 90 top
R10  26.47,31.93 90 top
R11  20.02,17.5 90 top
R12  12.47,17.45 0 top
R13  12.47,16.23 0 top
R14  50.04,17.3 180 top
R15  34.77,32.54 0 top
R16  37.29,35.08 90 top
R17  23.67,17.02 0 top
R18  62.99,17.3 0 top
R19  330  [0402-RES']  7.42,35.23 90 top
R20  20.09,14.38 90 top
R21  330  [0402-RES']  9.65,8.74 90 top
R22  330  [0402-RES']  6.17,8.71 90 top
R23  10K  [0402-RES']  13.34,11.66 270 top
R24  10K  [0402-RES']  12.9,28.98 90 top
R25  32.99,27.79 270 top
R26  31.5,27.79 270 top
R27  10k  [0402-RES']  10.08,22.25 180 top
RST  19.61,9.88 90 top
RST1  15.82,15.52 90 top
S2  5.33,27.2 90 top
T1  13.13,22.5 0 top
U1  61.72,20.35 90 top
U2  44.7,20.35 90 top
U3  19.96,15.27 180 bottom
U4  9.93,28.58 0 top
U5  6.45,15.49 0 top
U$2  55.12,33.55 270 top
U$3  48.51,30 180 top
U$4  17.2,33.99 0 top
U$5  38.39,10.63 45 top
U$6  59.56,26.11 90 top
U$14  30.05,9.04 90 top

### Tracks (layer width: path | path; a pad name or v marks a point on that pad's centre or on a via)
1.65V
  Top 0.406: IC7.4 40.48,30.32 IC7.1 41.18,29.65 40.31,28.78 40.31,26.52 41,25.83 41,21.06 41.4,20.65 42.42,20.65 U2.6
+3V3  (via drill 0.33, 0.41, 0.46)
  Top 0.152: 35.26,13.59 K1.30 | R7.2 18.34,16.59 R11.2
  Top 0.254: K1.48 34.42,23.22 28.55,17.35 v27.84,17.35 | U$14.1 28.22,7.44 v27.58,8.08 27.56,8.05 C15.1 | K1.7 25.96,20.22 25.48,19.74 25.48,19.41 24.97,18.9 23.55,18.9 23.11,19.33 | K1.21 30.76,15.29 31.75,16.05 32.77,16.05 34.04,15.01 34.77,15.01 35.26,14.5 35.26,13.59
  Top 0.406: v22.07,18.21 23.11,19.33 C25.1 23.14,21.18 23.95,21.18 24.97,22.2 | K1.30 v35.26,11.07 | K1.3 24.97,22.2 | v24.77,23.72 24.77,22.4 24.97,22.2
  Top 0.66: 21.65,21.21 21.69,21.25 | C25.1 23,21.27 C14.1 21.7,21.26 | R11.2 20.02,18.64 21.69,20.32 21.69,21.25 | 21.69,21.25 21.7,21.26 | 21.7,21.26 20.85,21.26 20.27,21.84 20.27,23.02 C18.1 20.21,22.96 LP38691.OUT LP38691.SNS
  Bottom 0.254: v27.84,17.35 25.04,17.37 24.66,17.35 v22.07,18.21 | v27.58,8.08 27.58,8.13 28.21,8.75
  Bottom 0.406: v35.26,11.07 33.07,9.04 32.28,8.26 28.7,8.26 28.21,8.75 27.64,9.32 27.64,11.25 23.95,14.94 23.95,15.6 23.34,16.33 v22.07,18.21 | U3.11 25.36,23.12 v24.77,23.72
+5V  (via drill 0.53, 0.66, 0.71, 0.76)
  Top 0.406: U1.8 58.97,19.37 57.4,17.81 57.4,17.46 C8.1 57.24,17.72 55.37,19.58 54.9,19.58 IC4.5 53.43,19.65 53.09,19.99 v53.09,20.6 | P8.6 57.83,10.59 58.17,10.92 59.99,10.92 60.4,11.33 60.4,12.37 61.54,13.51 v61.54,14.66 | U2.8 43.75,19.37 v44.68,20.29 | C23.1 49.78,25.76 v49.86,25.68
  Top 0.66: v29.87,30.2 29.04,30.93 C2.2 R10.1 26.15,31.08 U$4.6
  Bottom 0.406: v53.09,20.6 58.17,15.52 61.37,15.52 61.54,15.34 v61.54,14.66
  Bottom 0.66: v53.09,20.6 53.09,24.66 52.07,25.68 v49.86,25.68 40.89,25.68 40.64,25.93 | 40.64,25.93 v44.68,20.29 | 40.64,25.93 40.62,25.96 32.59,25.96 30.58,27.97 30.58,29.49 v29.87,30.2
-5V  (via drill 0.38, 0.53, 0.71, 0.76)
  Top 0.305: IC4.2 58.04,20.6 58.8,21.36 | 58.8,21.36 59.42,21.36 U1.5 | 58.8,21.36 v59.56,22.12
  Top 0.406: U2.5 42.44,23.25 C24.2 42.58,26.78 41.91,27.46 v41.88,27.46 | C13.2 57.16,25.16 v57.07,25.25 | P8.2 60.16,9.71 60.48,9.4 64.11,9.4 64.72,10.01 64.72,14.17 v63.93,14.96
  Top 0.66: U$4.4 19.23,36.07 20.07,36.07 26.73,36.04 R9.2 C1.1 29.22,35.88 v29.97,34.52
  Bottom 0.305: v59.56,22.12 59.56,22.76 v57.07,25.25
  Bottom 0.406: v63.93,14.96 63.93,20.22 58.85,25.3 57.12,25.3 v57.07,25.25
  Bottom 0.66: v29.97,34.52 29.97,32.31 32.08,30.18 32.08,28.47 33.1,27.46 v41.88,27.46 54.86,27.46 v57.07,25.25
ADC_A12
  Top 0.406: K1.11 28.5,18.21 34.49,24.21 36.75,24.21 37.8,25.25 39.42,25.25 39.95,24.71 39.95,20.98 40.91,20.02 U2.7
CTRL  (via drill 0.33, 0.38)
  Top 0.152: U$2.13 59.11,31.93 v59.21,32.03 | K1.49 36.27,30.15 35.71,30.99 33.98,30.99 32.18,32.79 v32.18,36.09
  Bottom 0.152: v59.21,32.03 59.21,33.83 56.11,36.93 53.77,36.93 53.06,36.22 32.31,36.22 v32.18,36.09
D1
  Top 0.152: D1.C 11.2,8.09 R21.1
D2
  Top 0.152: P8.14 53.82,8.84 53.52,8.53 41.17,8.53 40.41,9.3 35.99,9.3 34.62,10.67 34.62,11.53 34.75,11.66 34.75,13.52 K1.29
D3  (via drill 0.33, 0.38)
  Top 0.152: P8.15 53.33,12.95 v53.26,12.85 | K1.59 31.27,24.79 31.77,24.05 v31.77,23.37
  Bottom 0.152: v53.26,12.85 52.7,12.93 47.45,18.19 43.84,18.19 39.14,22.89 32.13,22.89 31.77,23.14 v31.77,23.37
D4  (via drill 0.33, 0.38)
  Top 0.152: P8.13 v54.33,12.32 | K1.60 30.79,24.79 v31.09,24
  Bottom 0.152: 54.3,12.29 v54.33,12.32 54,11.99 53.14,11.99 47.27,17.86 43.66,17.86 39.04,22.45 31.57,22.48 31.11,22.99 v31.09,24
D5  (via drill 0.33, 0.38)
  Top 0.152: P8.11 55.33,11.9 v55.35,11.89 | K1.61 30.25,24.79 30.5,24.36 v30.5,23.39
  Bottom 0.152: v55.35,11.89 55.09,11.63 52.98,11.63 47.12,17.5 43.43,17.5 38.91,21.89 31.45,22.12 30.76,22.78 v30.5,23.39
D6  (via drill 0.33, 0.38)
  Top 0.152: P8.9 v56.33,11.74 v56.34,11.73 | K1.62 29.77,24.23 v29.92,24.08
  Bottom 0.152: v56.34,11.73 55.78,11.18 52.88,11.18 46.97,17.09 43.08,17.09 43.08,17.12 38.68,21.51 31.32,21.79 29.92,22.94 v29.92,24.08
D7  (via drill 0.33, 0.38)
  Top 0.152: P8.7 57.33,11.36 v57.3,11.33 | K1.1 27.84,23.22 v28.04,22.96
  Bottom 0.152: v57.3,11.33 56.79,10.82 43.18,10.87 43.13,10.87 33.78,20.22 30.91,20.73 v28.04,22.96
D8  (via drill 0.33, 0.38)
  Top 0.152: P8.5 58.33,12.87 v58.32,12.85 | K1.2 27.46,22.71 v28.07,22.07
  Bottom 0.152: v58.32,12.85 58.32,11.38 57.38,10.44 42.95,10.44 33.53,19.86 30.81,20.37 28.63,21.87 28.63,21.89 28.25,21.89 v28.07,22.07
D9
  Top 0.152: D2.C 7.16,8.06 R22.1
D14  (via drill 0.33, 0.38)
  Top 0.152: P8.1 60.33,15.18 59.99,15.52 56.74,15.52 v56.69,15.57 | K1.57 32.28,24.82 v32.92,24.26
  Bottom 0.152: v56.69,15.57 53.11,19.15 44.04,19.15 39.24,23.88 33.35,23.88 v32.92,24.26
D16  (via drill 0.33, 0.38)
  Top 0.152: P8.3 v59.33,12.45 | K1.58 31.75,24.77 v32.61,23.47
  Bottom 0.152: v59.33,12.45 59.33,13.49 58.04,14.78 56.36,14.78 55.7,15.44 55.7,15.9 52.96,18.64 43.92,18.64 39.12,23.47 v32.61,23.47
D17
  Top 0.152: P8.16 52.83,12.09 51.92,13.13 44.93,13.13 44.65,13.31 44.65,14.83 43.48,16.1 39.37,20.22 K1.42
D18
  Top 0.152: P8.18 51.89,9.77 51.89,11.94 51.21,12.67 44.88,12.67 44.3,13.06 44.3,14.66 43.36,15.7 39.34,19.71 K1.41
D19
  Top 0.152: P8.12 54.83,8.96 54.08,8.2 40.95,8.2 40.21,8.94 35.89,8.94 34.21,10.62 34.21,13.49 K1.28
D20
  Top 0.152: P8.10 55.8,9.69 55.8,8.81 54.89,7.9 40.74,7.9 40.03,8.61 35.74,8.61 33.71,10.64 33.71,13.49 K1.27
D21
  Top 0.152: P8.8 56.83,9.05 55.35,7.57 40.56,7.57 39.85,8.28 35.43,8.28 33.25,10.46 33.25,13.52 K1.26
D24  (via drill 0.33, 0.38)
  Top 0.152: P8.22 49.86,9.74 49.86,11.3 v49.61,11.56 | K1.63 29.26,24.49 29.34,24.41 v29.34,23.37
  Bottom 0.152: v49.61,11.56 49.61,13.23 46.18,16.66 42.82,16.66 38.43,21.06 31.17,21.46 29.34,22.78 v29.34,23.37
D25
  Top 0.152: P8.30 44.98,8.86 41.33,8.86 39.57,10.62 39.47,11.63 36.8,14.3 36.8,16.43 37.57,17.2 K1.36
D26
  Top 0.152: P8.28 46.86,9.74 46.86,10.59 46.56,10.9 45.39,10.9 45.19,10.69 44.88,9.83 43.48,9.19 41.48,9.19 39.93,10.72 39.78,11.91 37.21,14.48 37.21,16.26 37.67,16.71 K1.35
D31
  Top 0.152: 48.87,9.75 P8.24 48.74,9.8 48.74,10.49 47.65,11.58 44.93,11.58 44.4,10.95 43.87,10.29 43.13,9.86 41.78,9.86 41.43,10.21 41.43,16.23 39.45,18.21 K1.38
D32
  Top 0.152: P8.26 47.88,9.76 47.88,10.72 47.35,11.25 45.16,11.25 44.78,10.85 44.42,10.08 43.28,9.53 41.63,9.53 41.07,10.08 41.07,15.9 39.27,17.7 K1.37
D33  (via drill 0.33, 0.38)
  Top 0.152: P8.20 50.93,9.81 50.93,11.68 50.29,12.32 48.97,12.32 v48.67,12.01 | K1.64 v28.75,24
  Bottom 0.152: v48.67,12.01 48.06,12.01 46.05,14.02 44.83,14.02 38.25,20.6 31.06,21.13 28.75,22.81 v28.75,24
DIGIPOT
  Top 0.305: U1.7 59.48,20.04 60.22,20.04 60.54,20.36 NON_STAF.1 59.61,24.88 59.61,24.89 59.38,25.12 59.38,25.86 59.26,25.98 58.69,25.98 U$6.P5
FSYN  (via drill 0.33, 0.38)
  Top 0.152: U$2.16 57.41,33.88 v55.75,35.53 | K1.53 34.27,26.87 35.05,27.66 35.05,29.34 34.19,30.28 33.55,30.28 30.99,32.84 v30.99,33.02
  Bottom 0.152: v55.75,35.53 55.63,35.41 53.85,35.41 53.72,35.53 33.5,35.53 v30.99,33.02
GND  (via drill 0.33, 0.38, 0.41, 0.51)
  Top 0.152: 29.62,8.79 U$14.17
  Top 0.254: U$14.2 29.62,8.79 | U$5.GND1 37.19,12.93 v36.91,13.31 | K1.47 39.24,22.71 39.4,22.89 39.4,23.95 v38.86,24.46 | K1.4 27.13,21.72 v27.91,21.11
  Top 0.305: U$2.7 52.97,32.58 v53.85,31.7
  Top 0.406: U4.2 9.93,26.62 9.7,26.39 9.09,26.04 v8.61,26.01
  other vias: 54.1,25.93 61.47,21.36 54.36,16.03 59.18,28.98 62.69,15.67 60.4,37.69 57.86,37.69 55.32,37.69 52.78,37.69 50.24,37.69 65.2,35.41 65.2,32.87 65.46,28.55 65.46,26.01 65.46,23.47 65.46,20.93 65.46,18.39 65.46,15.85 65.71,13.31 65.71,10.77 60.38,8.23 57.84,8.23 47.7,37.69 45.16,37.69 42.62,37.69 40.08,37.69 37.54,37.69 35,37.69 32.46,37.69 29.92,37.69 27.38,37.69 24.84,37.69 22.3,37.69 19.76,37.69 17.22,37.69 14.68,37.69 12.14,37.69 9.6,37.69 9.58,6.71 12.12,6.71 14.66,6.71 19.74,6.71 22.28,6.71 24.82,6.71 27.36,6.71 37.52,6.71 40.06,6.71 42.6,6.71 45.14,6.71 47.68,6.71 50.22,6.71 52.76,6.71 55.3,6.71 57.84,6.71 60.38,6.71 17.2,6.71 60.38,35.41 25.04,34.37 30.4,36.17 61.34,27.61 30.02,9.27 35.51,15.85 33.99,16.51 33.93,17.78 32.31,17.12 40.44,11.71 17.65,24.49 24.59,26.31 25.83,29.06 27.64,29.39 15.7,34.39 16.94,31.06 4.78,21.69 4.78,19.15 4.78,16.61 4.78,14.07 27.53,25.32 26.62,24.23 12.65,13.82 18.06,18.54 28.63,26.8 54.05,23.98 34.98,6.71 21.59,13.46 22.43,11.81 23.14,23.77 19.23,31.06 21.26,31.06 20.24,26.8 20.27,25.6 8.31,23.67 8.31,22.38 7.06,37.69 4.52,37.69 7.04,6.71 4.75,6.71 4.78,11.53 4.78,8.99 14.94,19.66 10.62,19.91 12.4,18.64 15.19,26.77 20.52,29.06 9.93,30.05 62.92,37.69 62.92,35.41 62.92,8.23 62.92,6.71 65.46,6.71 65.46,8.23 65.2,37.69 63.93,30.33 65.46,30.84 15.95,20.42 14.17,18.9
  pour Top: 3.56,38.63 66.29,38.89 66.29,5.87 3.56,5.87
  pour Bottom: 3.63,38.63 66.29,38.89 66.29,5.87 3.63,5.87
I2CSCL  (via drill 0.33)
  Top 0.152: U$6.P3 59.66,26.65 v59.59,26.72 | K1.55 33.27,26.11 33.27,26.19 32.99,26.55 R25.2 34.02,27.2 34.72,27.94 34.72,28.55 v34.31,29.24
  Bottom 0.152: v59.59,26.72 58.09,26.72 57.89,26.92 56.97,26.92 55.19,28.7 35.56,28.7 34.85,29.41 34.49,29.41 v34.31,29.24
I2CSDA  (via drill 0.33)
  Top 0.152: U$6.P4 57.97,26.65 v57.66,26.34 | v29.79,27.2 v29.8,27.21 R26.2 32.77,25.94 K1.56 | v34.06,28.4 33.93,28.4 33.73,28.6 33.73,29.57 33.25,30.05 31.42,30.05 30.56,29.18 v29.46,29.18
  Bottom 0.152: v57.66,26.34 57.1,26.34 55.07,28.37 v34.06,28.4 | v29.79,27.2 29.79,27.23 29.39,27.64 29.39,29.11 v29.46,29.18
IOUT
  Top 0.305: C12.2 R3.2 | R3.2 60.5,30.52 C31.1 C20.1 | U$2.19 58.71,35.83 59.38,35.15 59.38,32.88 R3.2
N$1  (via drill 0.38)
  Top 0.152: U$2.1
  Top 0.305: R1.2 50.55,36.2 50.83,36.47 U$2.1 52.85,36.48 53.31,36.02 53.31,35.71 53.67,35.36 53.67,34.95 v53.57,34.85 | C4.2 39.56,35.9 38.71,35.05 v38.71,34.59
  Bottom 0.305: v38.71,34.59 38.71,34.57 38.94,34.34 51.92,34.34 52.43,34.85 v53.57,34.85
N$2
  Top 0.152: U$2.3 51.16,35.18 50.88,34.9 47.4,34.9 47.24,35.05 45.22,35.05 C6.2
N$3
  Top 0.152: C5.2 47,35.93 47.55,35.38 50.7,35.38 51.16,35.84 52.19,35.84 U$2.2
N$4
  Top 0.305: U$2.6 53.5,33.23 C9.2
N$5
  Top 0.305: U$2.8 49.68,31.93 U$3.P$3 49.28,32.56 50.01,33.3 50.01,33.9 R2.2
N$6
  Top 0.305: U$2.9 53.16,31.28 C10.2
N$7
  Top 0.305: U$2.10 52.2,29.96 C11.2
N$8
  Top 0.305: R4.1 60.54,17.61 62.94,20.02 U1.2
N$9
  Top 0.406: IC7.3 40.22,32.22 39.4,33.05 38.11,33.05 R16.1 36.63,33.57 36.63,33.38 35.93,32.65 R15.2 35.59,33.47 C28.1
N$10  (via drill 0.33, 0.46)
  Top 0.152: U$14.9 30.8,11.19 v30.76,11.53 | K1.24 v32.26,15.34
  Bottom 0.152: v30.76,11.53 32.28,12.98 v32.26,15.34
N$11  (via drill 0.33)
  Top 0.229: K1.5 25.93,21.21 25.81,21.34 25.2,21.34 24.66,20.8 24.66,19.81 v24.51,19.71 | R13.2 13.77,16.23 v14.02,16.48
  Bottom 0.229: v24.51,19.71 24.11,19.71 23.82,19.91 17.45,19.91 v14.02,16.48
N$12  (via drill 0.33)
  Top 0.229: R12.2 13.72,17.45 v14.02,17.75
  Top 0.254: K1.6 25.53,20.7 v25.35,20.52
  Bottom 0.229: v25.35,20.52 24.84,20.37 17.27,20.37 14.66,17.75 v14.02,17.75
N$13
  Top 0.229: U5.D+1 11.15,15.49 R13.1
N$14  (via drill 0.33)
  Top 0.254: K1.17 28.45,13.54 v27.89,12.9 | C16.1 24.72,13.59 v25.96,14.86
  Bottom 0.254: v27.89,12.9 27.79,12.9 v25.96,14.86
N$15
  Top 0.305: U1.4 63.84,21.46 R5.2 63.84,27.75 62.74,28.85 C20.2
N$16
  Top 0.305: R4.2 58.88,17.3 62.26,20.68 U1.3
N$21
  Top 0.229: U5.D-1 10.96,16.14 11.07,16.26 11.07,16.79 R12.1
N$22  (via drill 0.33, 0.38)
  Top 0.152: U$14.6 32.05,8.79 32.54,8.84 32.84,9.14 32.84,10.69 31.75,12.09 K1.23 31.75,14.5 v31.5,14.76 | U5.ID1 11.01,14.84 v11.02,14.86
  Bottom 0.152: v31.5,14.76 31.24,15.01 31.24,19.23 30,20.47 28.52,20.47 27.58,19.53 25.81,19.53 25.17,19.02 24.28,19.02 23.65,19.53 20.93,19.53 18.36,17.02 18.36,16.99 16.03,14.66 11.23,14.66 v11.02,14.86
N$23
  Top 0.152: K1.22 31.24,13.52 31.24,12.12 31.52,11.73 31.52,10.1 U$14.8
N$24
  Top 0.305: IC4.4 56.73,19.65 IC4.1 57.93,19.65 58.93,20.65 59.44,20.65 U1.6
N$25
  Top 0.254: U$5.SIG1 37.05,11.52 36.25,12.27 36.25,13.52 K1.32
N$26
  Top 0.254: U$5.SIG2 38.97,15.16 K1.33
N$27
  Top 0.254: R17.2 C17.1 25.57,16.71 K1.14
N$28
  Top 0.254: C17.2 21.87,15.82 | 21.87,15.82 C19.2 | K1.15 K1.16 25.81,15.7 24.71,14.61 23.16,14.61 C16.2 21.67,14.63 | 21.67,14.63 21.51,14.68 R20.2 | 21.87,15.82 21.87,14.76 21.67,14.63
N$29
  Top 0.254: K1.13 25.65,17.2 24.97,17.88 23.52,17.88 23.09,17.45 R17.1 | 21.95,17.02 C19.1 21.42,16.86
  Top 0.66: R17.1 21.95,17.02 | R11.1 20.45,16.74 20.78,17.07 21.69,17.07 C19.1
N$30  (via drill 0.33)
  Top 0.152: D1.A 11.52,9.64 v12.04,10.92
  Bottom 0.152: U3.21 16.96,9.32 15.37,10.92 v12.04,10.92
N$31
  Top 0.305: R18.2 63.84,19.23 U1.1
N$32  (via drill 0.33)
  Top 0.152: D2.A 7.87,9.91 8.38,10.41 10.26,10.41 v12.04,11.86
  Bottom 0.152: U3.19 19.36,9.41 17.25,11.53 12.9,11.53 v12.04,11.86
N$33
  Top 0.152: D4.A R19.1
N$34  (via drill 0.51)
  Top 0.406: T1.6 12.25,23.31 v11.71,22.61 | T1.3 13.78,20.33 v13.13,19.69
  Bottom 0.406: v13.13,19.69 12.83,19.69 11.76,20.75 11.71,20.9 v11.71,22.61
N$36
  Top 0.305: R6.1 C22.1 47.59,21.94 U2.4
N$37
  Top 0.305: R14.2 C27.1 47.6,17.31 47.6,18.26 46.97,18.9 U2.1
N$38
  Top 0.305: U2.2 48.23,20.02 48.72,19.53 49.49,19.53 R8.1
N$39
  Top 0.305: U2.3 48.2,20.67 48.72,21.18 49.52,21.18 R8.2
N$66
  Top 0.152: PROG.3 17.6,9.9 18.47,9.88 26.01,9.88 27.69,11.56 29.82,11.56 30.18,11.2 30.18,10.77 U$14.10
N$72  (via drill 0.33)
  Top 0.152: K1.25 32.77,12.78 v32.61,12.22 | U$14.7 32,9.29 32.26,9.55 32.26,10.44 v32.18,10.52
  Bottom 0.152: v32.18,10.52 v32.61,12.22
PIN_BTN
  Top 0.152: K1.43 33.38,20.68 24.82,12.12 24.82,11.18 24.23,10.46 18.31,10.46 17.88,10.9 17.88,13.26 17.97,13.35 | 17.97,13.35 R7.1 | RST1.3 17.67,13.64 17.97,13.35
PIO4  (via drill 0.33)
  Top 0.152: R23.2 v13.39,10.11
  Bottom 0.152: U3.22 15.76,9.2 15.74,9.2 14.86,10.08 v13.39,10.11
PROG
  Top 0.406: U4.5 8.98,30.34 9.86,31.22 11.3,31.22 11.81,30.71 11.81,28.85 12.29,28.37 12.86,28.37 R24.1
RECE1
  Top 0.406: P8.31 45.33,15.55 44.7,16.18 44.7,18.44 45.74,19.48 45.74,23.25 C22.2
RECE2
  Top 0.406: P8.29 46.33,16 45.9,16.43 C27.2
RST  (via drill 0.33)
  Top 0.152: U$14.13 28.26,9.8 27,9.8 26.57,9.37 23.22,9.37 21.15,9.36 RST.3 22.65,8.01 v23.47,7.19 | U$14.4 31.42,7.44 v31.5,7.39 | K1.34 37.77,16.21 37.57,16 37.57,15.19 v37.85,14.71
  Bottom 0.152: v23.47,7.19 23.8,7.39 v31.5,7.39 32.84,7.39 37.9,12.47 37.9,14.66 v37.85,14.71
RTS  (via drill 0.46)
  Top 0.254: K1.44 33.25,21.16 24.36,12.29 v24.08,11.58
  Bottom 0.254: U3.15 24.09,11.49 v24.08,11.58
RX1  (via drill 0.46)
  Top 0.254: K1.39 32.61,18.64 26.52,12.47 26.42,11.61 v25.45,10.64
  Bottom 0.254: U3.14 25.36,10.56 v25.45,10.64
SCL  (via drill 0.33, 0.38)
  Top 0.152: U$2.15 56.94,33.23 v55.98,34.19 | K1.50 35.76,27.31 35.84,27.38 35.84,29.82 v35.46,30.33
  Bottom 0.152: v55.98,34.19 53.09,34.19 52.38,33.48 52.38,32.33 50.16,30.12 v35.46,30.33
SDA  (via drill 0.33, 0.38)
  Top 0.152: U$2.14 55.56,32.58 54.43,33.71 54.43,35.74 v54.08,36.09 | K1.51 35.26,27.25 35.48,27.48 35.48,29.41 34.37,30.63 33.81,30.63 31.57,32.87 v31.57,34.52
  Bottom 0.152: v54.08,36.09 53.85,35.86 32.92,35.86 v31.57,34.52
STAT
  Top 0.152: U4.1 8.98,27.67 7.82,28.7 6.4,28.7 6.1,28.98 6.1,29.92 5.69,30.33 5.69,31.42 5.99,31.72 7.16,31.72 7.39,31.95 7.39,32.42 D4.C 7.41,32.33
TX1  (via drill 0.46)
  Top 0.254: K1.40 32.46,19.15 26.04,12.7 25.55,12.09 v25.53,11.84
  Bottom 0.254: U3.13 26.56,10.77 v25.53,11.84
VBAT_RAW  (via drill 0.76)
  Top 0.406: U4.3 12.97,27.28 13.36,26.92 | 13.36,26.92 14.22,27.79 C34.1 | T1.4 14.65,23.31 14.91,23.57 14.88,25.63 13.36,26.92
  Top 0.66: C34.1 15.07,28.33 v15.88,29.13
  Bottom 0.66: v15.88,29.13 15.88,29.41 13.56,31.72 9.2,31.72 7.92,32.97 7.06,32.97 JP1.2
VCC  (via drill 0.41, 0.46)
  Top 0.305: C7.2 C6.1 | v39.5,29.41 39.14,29.59 37.39,29.59 36.83,30.15 36.83,30.67 36.8,30.7 | U$6.P1 61.44,25.35 v61.59,25.2 62.46,26.06 C32.1
  Top 0.406: U$3.P$1 U$3.P$4 | 38.5,30.39 IC7.5 38.2,30.7 36.8,30.7 v36.8,31.67 36.6,31.47 34.47,31.47 33.92,32.02 R15.1 33.92,34.16 C26.2 | U$3.P$4 44.7,31.65 | U$3.P$4 43.71,31.52 v42.72,32.51 42.37,32.87 C7.2 | v50.93,32.77 51.1,33.17 51.1,33.5 51.48,33.88 U$2.5 U$2.4 | 27.56,27.61 C29.1 | R25.1 v32.99,29.36
  Top 0.66: R25.1 R26.1 31.37,28.24 28.14,28.24 27.74,28.09 27.38,27.66 C29.1 27.3,27.74 LP1.OUT LP1.SNS 24.63,28.67 C3.1 24.07,30.57 22.1,32.54 12.5,32.54 U$4.1
  Bottom 0.305: v39.5,29.41 39.88,29.64 56.39,29.64 58.42,27.61 60.12,27.61 61.57,26.16 61.57,25.22 v61.59,25.2
  Bottom 0.406: v50.93,32.77 42.98,32.77 v42.72,32.51 37.52,32.51 v36.8,31.67 36.6,31.47 34.47,31.47 32.99,30 v32.99,29.36
VCCS_OUT
  Top 0.305: IC4.3 57.85,21.55 58.8,22.5 58.8,23.35 NON_STAF.2 58.84,25.19 U$6.P6
  Top 0.406: IC4.3 56.35,22.63 52.96,22.63 51.51,21.18 51.51,19.89 53.16,18.24 53.16,16.18 52.33,15.35 P8.17
VIN  (via drill 0.76)
  Top 0.406: LP1.IN 23.57,24.84 22.3,26.11 21.69,26.11 C30.1 23.28,27.74 LP1.IN2
  Top 0.66: v17.68,27.89 20.8,27.89 21.49,27.2 21.49,26.31 C30.1 | S2.2 7.08,27.48 v7.49,27.89 | LP38691.IN2 19.08,26.46 v17.68,27.89 | LP38691.IN 16.26,26.57 v17.68,27.89 | C21.1 17.66,28.4 v17.68,27.89
  Bottom 0.66: v7.49,27.89 v17.68,27.89
VPOWER
  Top 0.406: T1.1 12.43,21.7 11.81,21.06 8.48,21.03 7.37,21.77 7.37,24.72 S2.1 7.15,25.02 9.09,25.02 9.98,25.73 13.49,25.73 14.03,25.19 D5.C
VUSB  (via drill 0.51)
  Top 0.152: R19.2 8.01,35.88 8.31,35.59 8.31,31.62 v7.52,30.84
  Top 0.406: U5.VBUS1 9.94,16.79 10.59,17.45 11.79,19.69 13.11,21.01 T1.2 T1.5 13.13,24.33 12.72,24.74 11.78,24.74 D5.A | R27.1 C33.1 10.73,23.8 D5.A | U4.4 10.86,29.38 10.38,28.83 8.66,28.83 7.43,29.45 S2.3 7.54,29.92 7.54,30.81 v7.52,30.84 | D5.A 11.7,24.82 v10.31,24.82
  Bottom 0.406: v10.31,24.82 7.34,24.82 6.5,25.65 6.5,29.85 v7.52,30.84